# Altium schematic sheet Unused.SchDoc
size A; DocumentNumber: 12; SheetNumber: 12; SheetTotal: 13
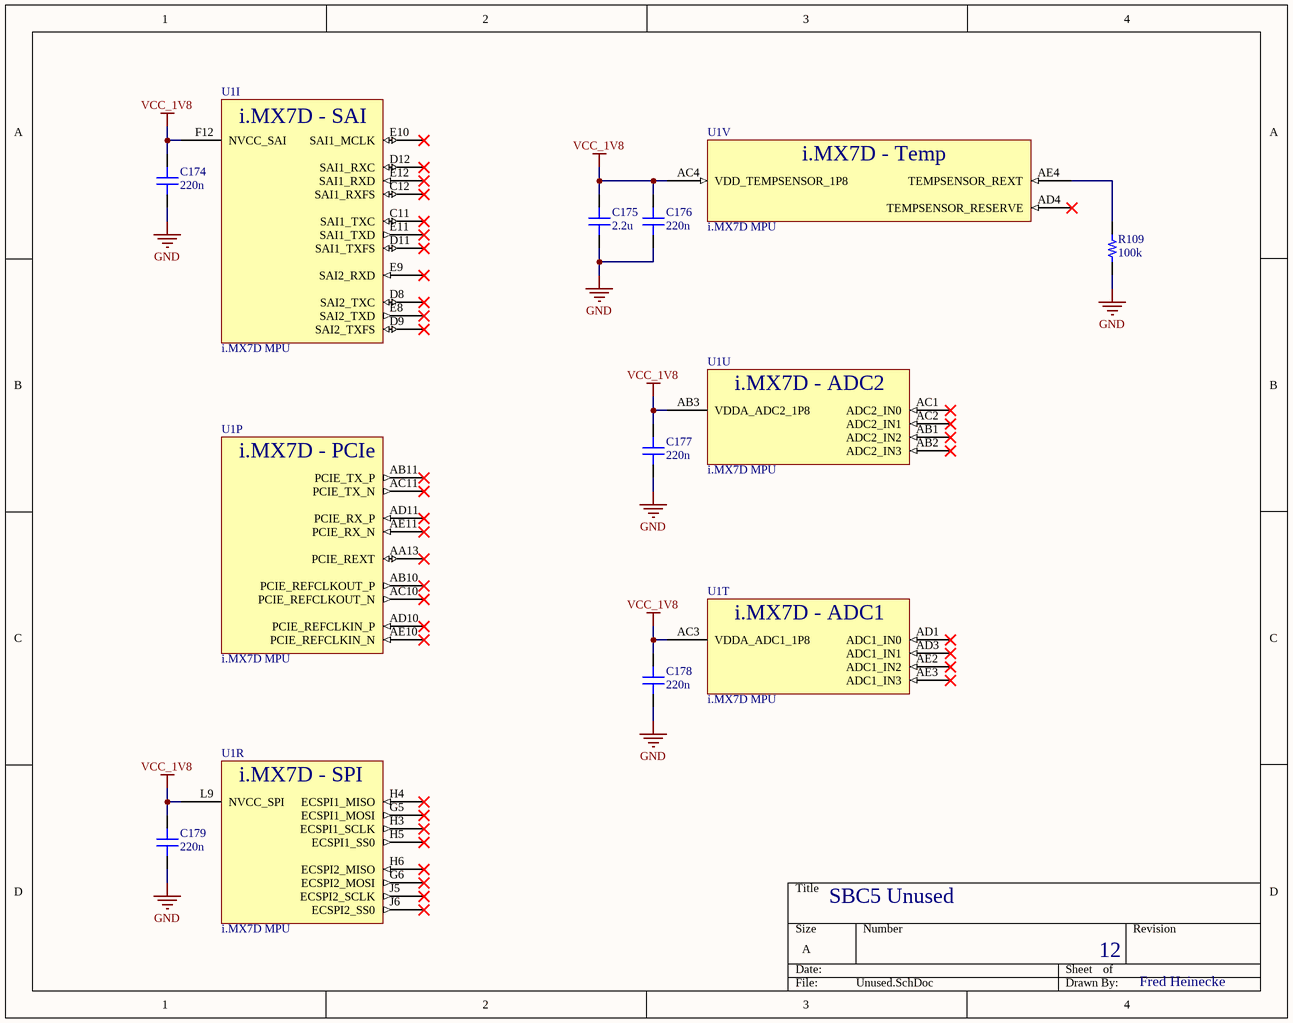
[diagram p0: Unused.SchDoc]

## Parts
C174  220n  [C0201]
C175  2.2u  [C0402]
C176  220n  [C0201]
C177  220n  [C0201]
C178  220n  [C0201]
C179  220n  [C0201]
R109  100k  [R0201]
U1  i.MX7D MPU  [BGA541C75P25X25_1900X1900X140]  (parts I,P,R,T,U,V of 23)

## Nets
GND: C174.1 C175.1 C176.1 C177.1 C178.1 C179.1 R109.1
VCC_1V8: C174.2 C175.2 C176.2 C177.2 C178.2 C179.2 U1.AB3(VDDA_ADC2_1P8) U1.AC3(VDDA_ADC1_1P8) U1.AC4(VDD_TEMPSENSOR_1P8) U1.F12(NVCC_SAI) U1.L9(NVCC_SPI)
NetR109_2: R109.2 U1.AE4(TEMPSENSOR_REXT)

Not connected (* = marked no-connect by the designer): U1 AA13(PCIE_REXT)* AB1(ADC2_IN2)* AB2(ADC2_IN3)* AB10(PCIE_REFCLKOUT_P)* AB11(PCIE_TX_P)* AC1(ADC2_IN0)* AC2(ADC2_IN1)* AC10(PCIE_REFCLKOUT_N)* AC11(PCIE_TX_N)* AD1(ADC1_IN0)* AD3(ADC1_IN1)* AD4(TEMPSENSOR_RESERVE)* AD10(PCIE_REFCLKIN_P)* AD11(PCIE_RX_P)* AE2(ADC1_IN2)* AE3(ADC1_IN3)* AE10(PCIE_REFCLKIN_N)* AE11(PCIE_RX_N)* C11(SAI1_TXC)* C12(SAI1_RXFS)* D8(SAI2_TXC)* D9(SAI2_TXFS)* D11(SAI1_TXFS)* D12(SAI1_RXC)* E8(SAI2_TXD)* E9(SAI2_RXD)* E10(SAI1_MCLK)* E11(SAI1_TXD)* E12(SAI1_RXD)* G5(ECSPI1_MOSI)* G6(ECSPI2_MOSI)* H3(ECSPI1_SCLK)* H4(ECSPI1_MISO)* H5(ECSPI1_SS0)* H6(ECSPI2_MISO)* J5(ECSPI2_SCLK)* J6(ECSPI2_SS0)*

## Notes on the sheet
- SBC5 Unused
- 12
- Fred Heinecke
- (in symbol MCIMX7D2DVM12SD, part I) i.MX7D - SAI
- (in symbol MCIMX7D2DVM12SD, part P) i.MX7D - PCIe
- (in symbol MCIMX7D2DVM12SD, part R) i.MX7D - SPI
- (in symbol MCIMX7D2DVM12SD, part T) i.MX7D - ADC1
- (in symbol MCIMX7D2DVM12SD, part U) i.MX7D - ADC2
- (in symbol MCIMX7D2DVM12SD, part V) i.MX7D - Temp

## Library data of the parts
C174 C176-C179 = GRM033R61C224KE14D: Cap Ceramic Monolithic 0.22uF 16VDC 10% SMD Paper T/R; Manufacturer: Murata; Supplier 1: Digi-Key; Manufacturer Part Number: GRM033R61C224KE14D; RoHS: No; Stock 1: 16192; Pricing 1: 1=0.10000, 10=0.03900, 50=0.02120, 100=0.01720, 500=0.01232, 1000=0.00968, 2500=0.00880, 5000=0.00810 (USD); ComponentLink1URL: https://search.murata.co.jp/Ceramy/image/img/A01X/G101/ENG/GRM033R61C224KE14-01.pdf?src-supplier=Digi-Key; ComponentLink1Description: https://search.murata.co.jp/Ceramy/image/img/A01X/G101/ENG/GRM033R61C224KE14-01.pdf?src-supplier=Digi-Key; Supplier Part Number 1: 490-17040-1-ND
C175 = LMK105BJ225MV-F: TAIYO YUDEN         LMK105BJ225MV-F            CERAMIC CAPACITOR, 2.2UF, 10V, X5R, 20%, 0402; Supplier 1: Digi-Key; Manufacturer: Taiyo Yuden; Manufacturer Part Number: LMK105BJ225MV-F; RoHS: Yes; Category: Ceramic Capacitors; Stock 1: 422093; Pricing 1: 1=0.10000, 10=0.05800, 50=0.03160, 100=0.02590, 500=0.01848, 1000=0.01452, 2500=0.01320, 5000=0.01214 (USD); Mount: Surface Mount; Case/Package: 0402; Case Code (Imperial): 0402; Case Code (Metric): 1005; Min Operating Temperature: -55°C; Max Operating Temperature: 85°C; Termination: SMD/SMT; Packaging: Tape and Reel; Capacitance: 2.2uF; Tolerance: 20%; Voltage Rating: 10V; Package Quantity: 1; Voltage Rating (DC): 10V; Dielectric: X5R; Resistor Type: Ceramic; Length: 1mm; Width: 0.5mm; Height: 0.5mm; Thickness: 0.022inch; Depth: 0.5mm; Radiation Hardening: No; Halogen Free: Halogen Free; REACH SVHC: Unknown; ComponentLink1URL: https://datasheet.ciiva.com/30190/500lmk105bj225mv-f-30190498.pdf?src-supplier=Onlinecomponents.com; ComponentLink1Description: https://datasheet.ciiva.com/30190/500lmk105bj225mv-f-30190498.pdf?src-supplier=Onlinecomponents.com; ComponentLink2URL: https://datasheet.ciiva.com/23631/lmk105bj225mv-f-ss-23631491.pdf?src-supplier=Newark; ComponentLink2Description: https://datasheet.ciiva.com/23631/lmk105bj225mv-f-ss-23631491.pdf?src-supplier=Newark; ComponentLink3URL: https://datasheet.ciiva.com/134/lmk105bj225mv-f-ss-134677.pdf?src-supplier=Digi-Key; ComponentLink3Description: https://datasheet.ciiva.com/134/lmk105bj225mv-f-ss-134677.pdf?src-supplier=Digi-Key; ComponentLink4URL: https://datasheet.ciiva.com/15921/286lmk105bj225mv-f-15921222.pdf?src-supplier=Onlinecomponents.com; ComponentLink4Description: https://datasheet.ciiva.com/15921/286lmk105bj225mv-f-15921222.pdf?src-supplier=Onlinecomponents.com; Supplier Part Number 1: 587-3153-1-ND
R109 = ERJ-1GNF1003C: PANASONIC - ERJ1GNF1003C - RES, 100K, 1%, 0.05W, 0201, THICK FILM; Resistance: 100kR; Temperature Coefficient: 200ppm/°C; Power Rating: 50mW; Voltage Rating: 25V; Supplier 1: Digi-Key; Supplier Part Number 1: P122655CT-ND; Manufacturer: Panasonic; Manufacturer Part Number: ERJ-1GNF1003C; RoHS: Yes; Category: Chip SMD Resistors; Stock 1: 833904; Pricing 1: 1=0.10000, 10=0.04600, 100=0.01890, 1000=0.00848, 2500=0.00736, 5000=0.00608 (USD); Mount: Surface Mount; Case/Package: 0201; Number of Pins: 2; Contact Plating: Tin,Matte; Case Code (Metric): 0603; Case Code (Imperial): 0201; Weight: 6E-06oz; Size Code: 0201; Min Operating Temperature: -55°C; Max Operating Temperature: 125°C; Tolerance: 1%; Resistor Type: Thick Film; Packaging: Tape and Reel; Package Quantity: 15000; Number of Terminations: 2; Max Power Dissipation: 50mW; Termination: SMD/SMT; Voltage Rating (DC): 25V; Series: ERJ; Resistance Tolerance: 1%; Length: 0.024inch; Width: 0.012inch; Height: 0.01inch; Radiation Hardening: No; REACH SVHC: No SVHC; Lead Free: Lead Free; RoHS Compliant: Yes; ComponentLink1URL: https://datasheet.ciiva.com/7830/1678782-7830709.pdf?src-supplier=Element14; ComponentLink1Description: https://datasheet.ciiva.com/7830/1678782-7830709.pdf?src-supplier=Element14; ComponentLink2URL: https://datasheet.ciiva.com/16508/aoa0000ce2-16508328.pdf?src-supplier=Future+Electronics; ComponentLink2Description: https://datasheet.ciiva.com/16508/aoa0000ce2-16508328.pdf?src-supplier=Future+Electronics; ComponentLink3URL: https://datasheet.ciiva.com/24161/aoa0000ce2-24161032.pdf?src-supplier=Mouser; ComponentLink3Description: https://datasheet.ciiva.com/24161/aoa0000ce2-24161032.pdf?src-supplier=Mouser; ComponentLink4URL: https://datasheet.ciiva.com/43467/1678782-43467102.pdf?src-supplier=Farnell; ComponentLink4Description: https://datasheet.ciiva.com/43467/1678782-43467102.pdf?src-supplier=Farnell
U1 = MCIMX7D2DVM12SD: Heterogeneous Multicore Processing Architecture; Manufacturer: NXP Freescale; Manufacturer Part Number: MCIMX7D2DVM12SD; Stock 1: 0; Pricing 1: 168=18.42238 (USD); ComponentLink1Description: Datasheet; ComponentLink1URL: https://www.nxp.com/docs/en/data-sheet/IMX7DCEC.pdf; ComponentLink2Description: Reference manual; ComponentLink2URL: https://www.nxp.com/docs/en/reference-manual/IMX7DRM.pdf; ComponentLink3Description: Hardware Development Guide; ComponentLink3URL: https://www.nxp.com/docs/en/user-guide/IMX7DSHDG.pdf; Supplier 1: Digi-Key; Supplier Part Number 1: 568-15401-ND